# EAGLE design riffle-beta-0.1.8.5 (EAGLE 7.5.0)
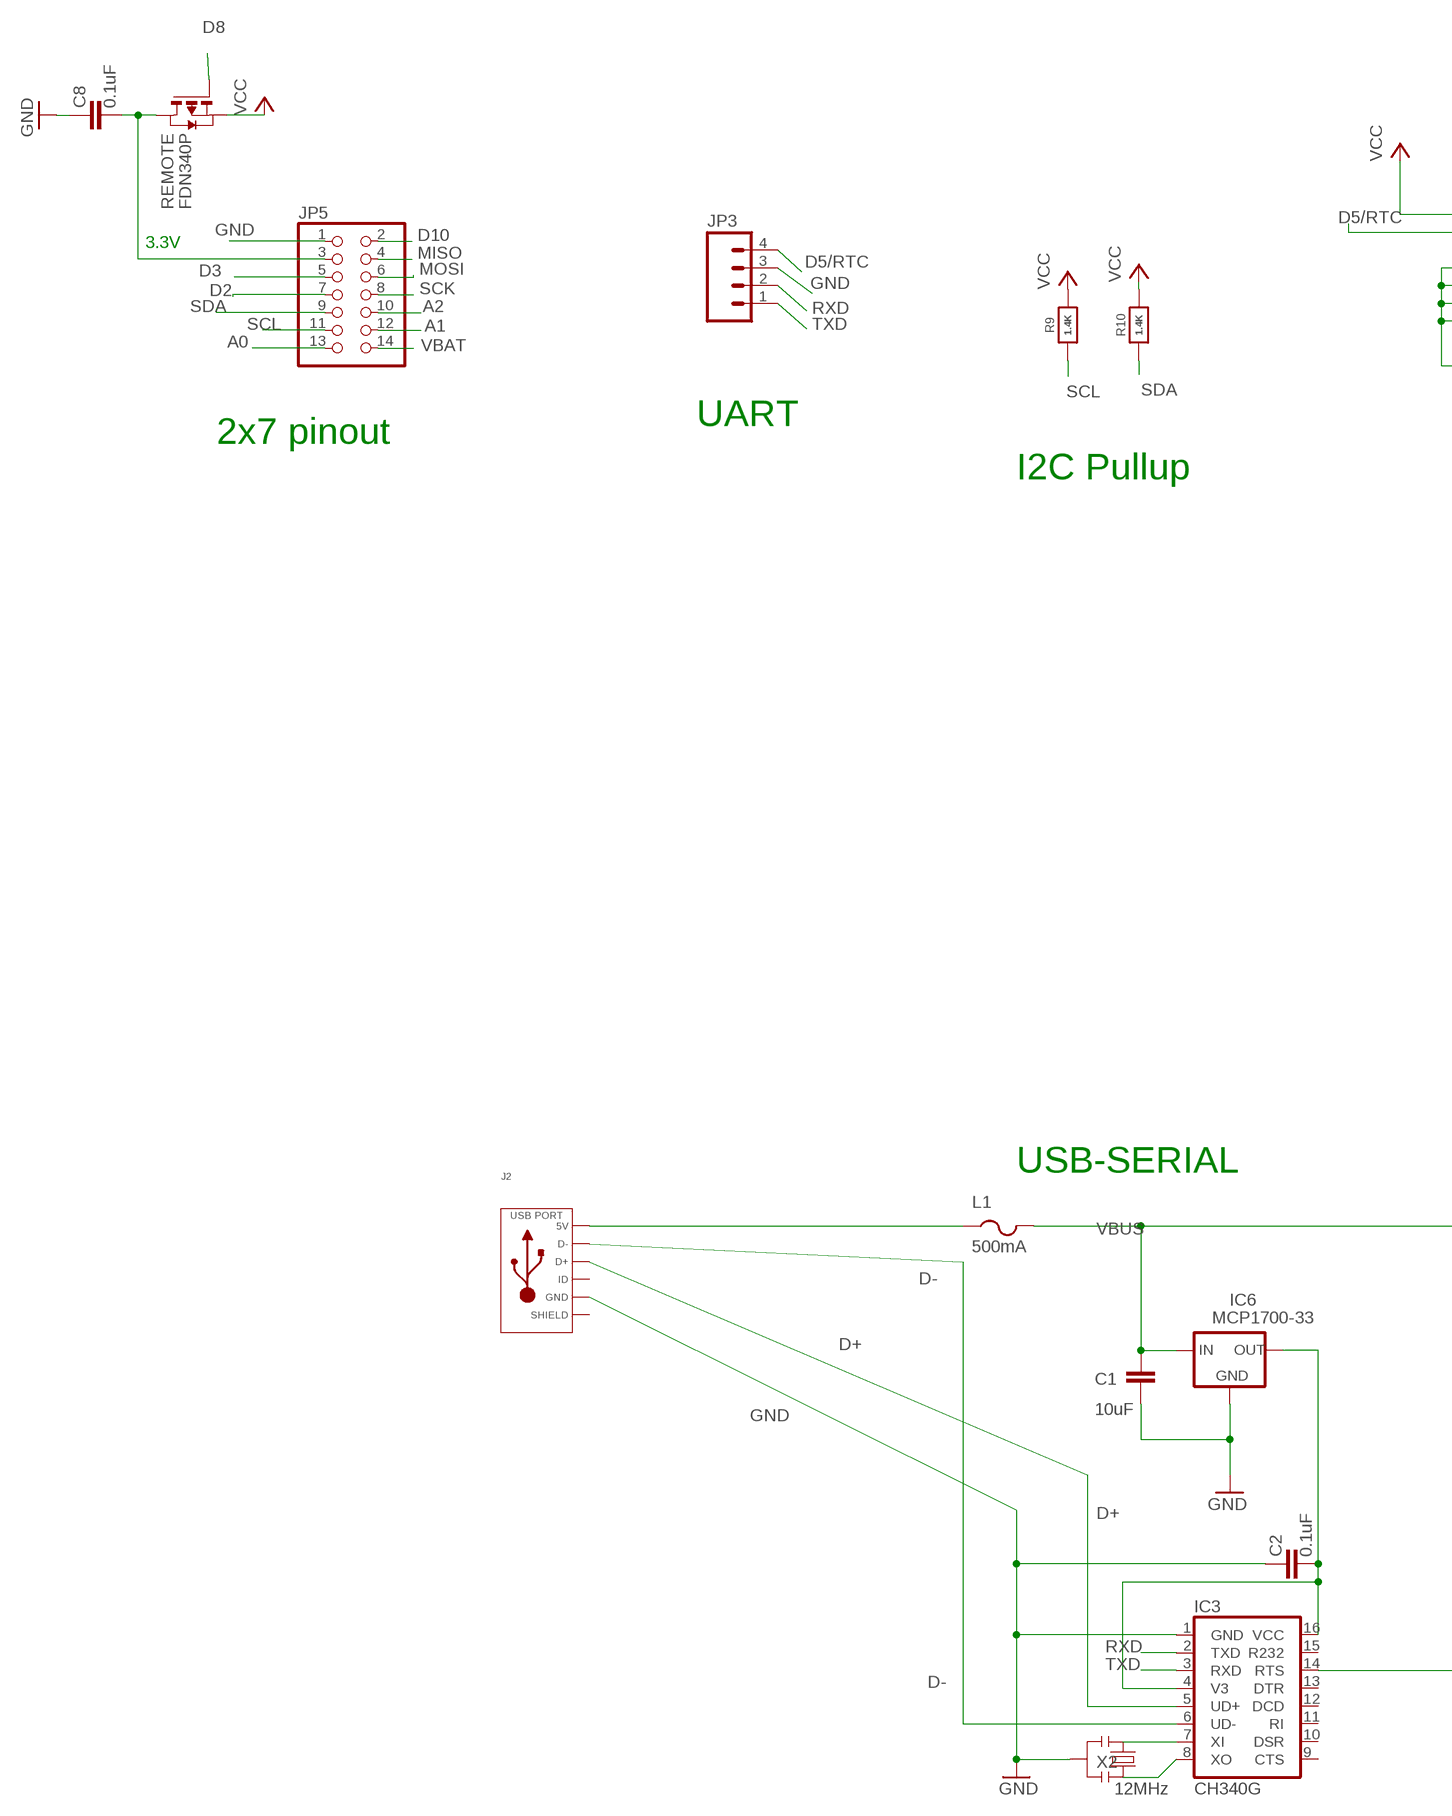
[diagram p0: schematic, sheet 1, part 1 of 2]
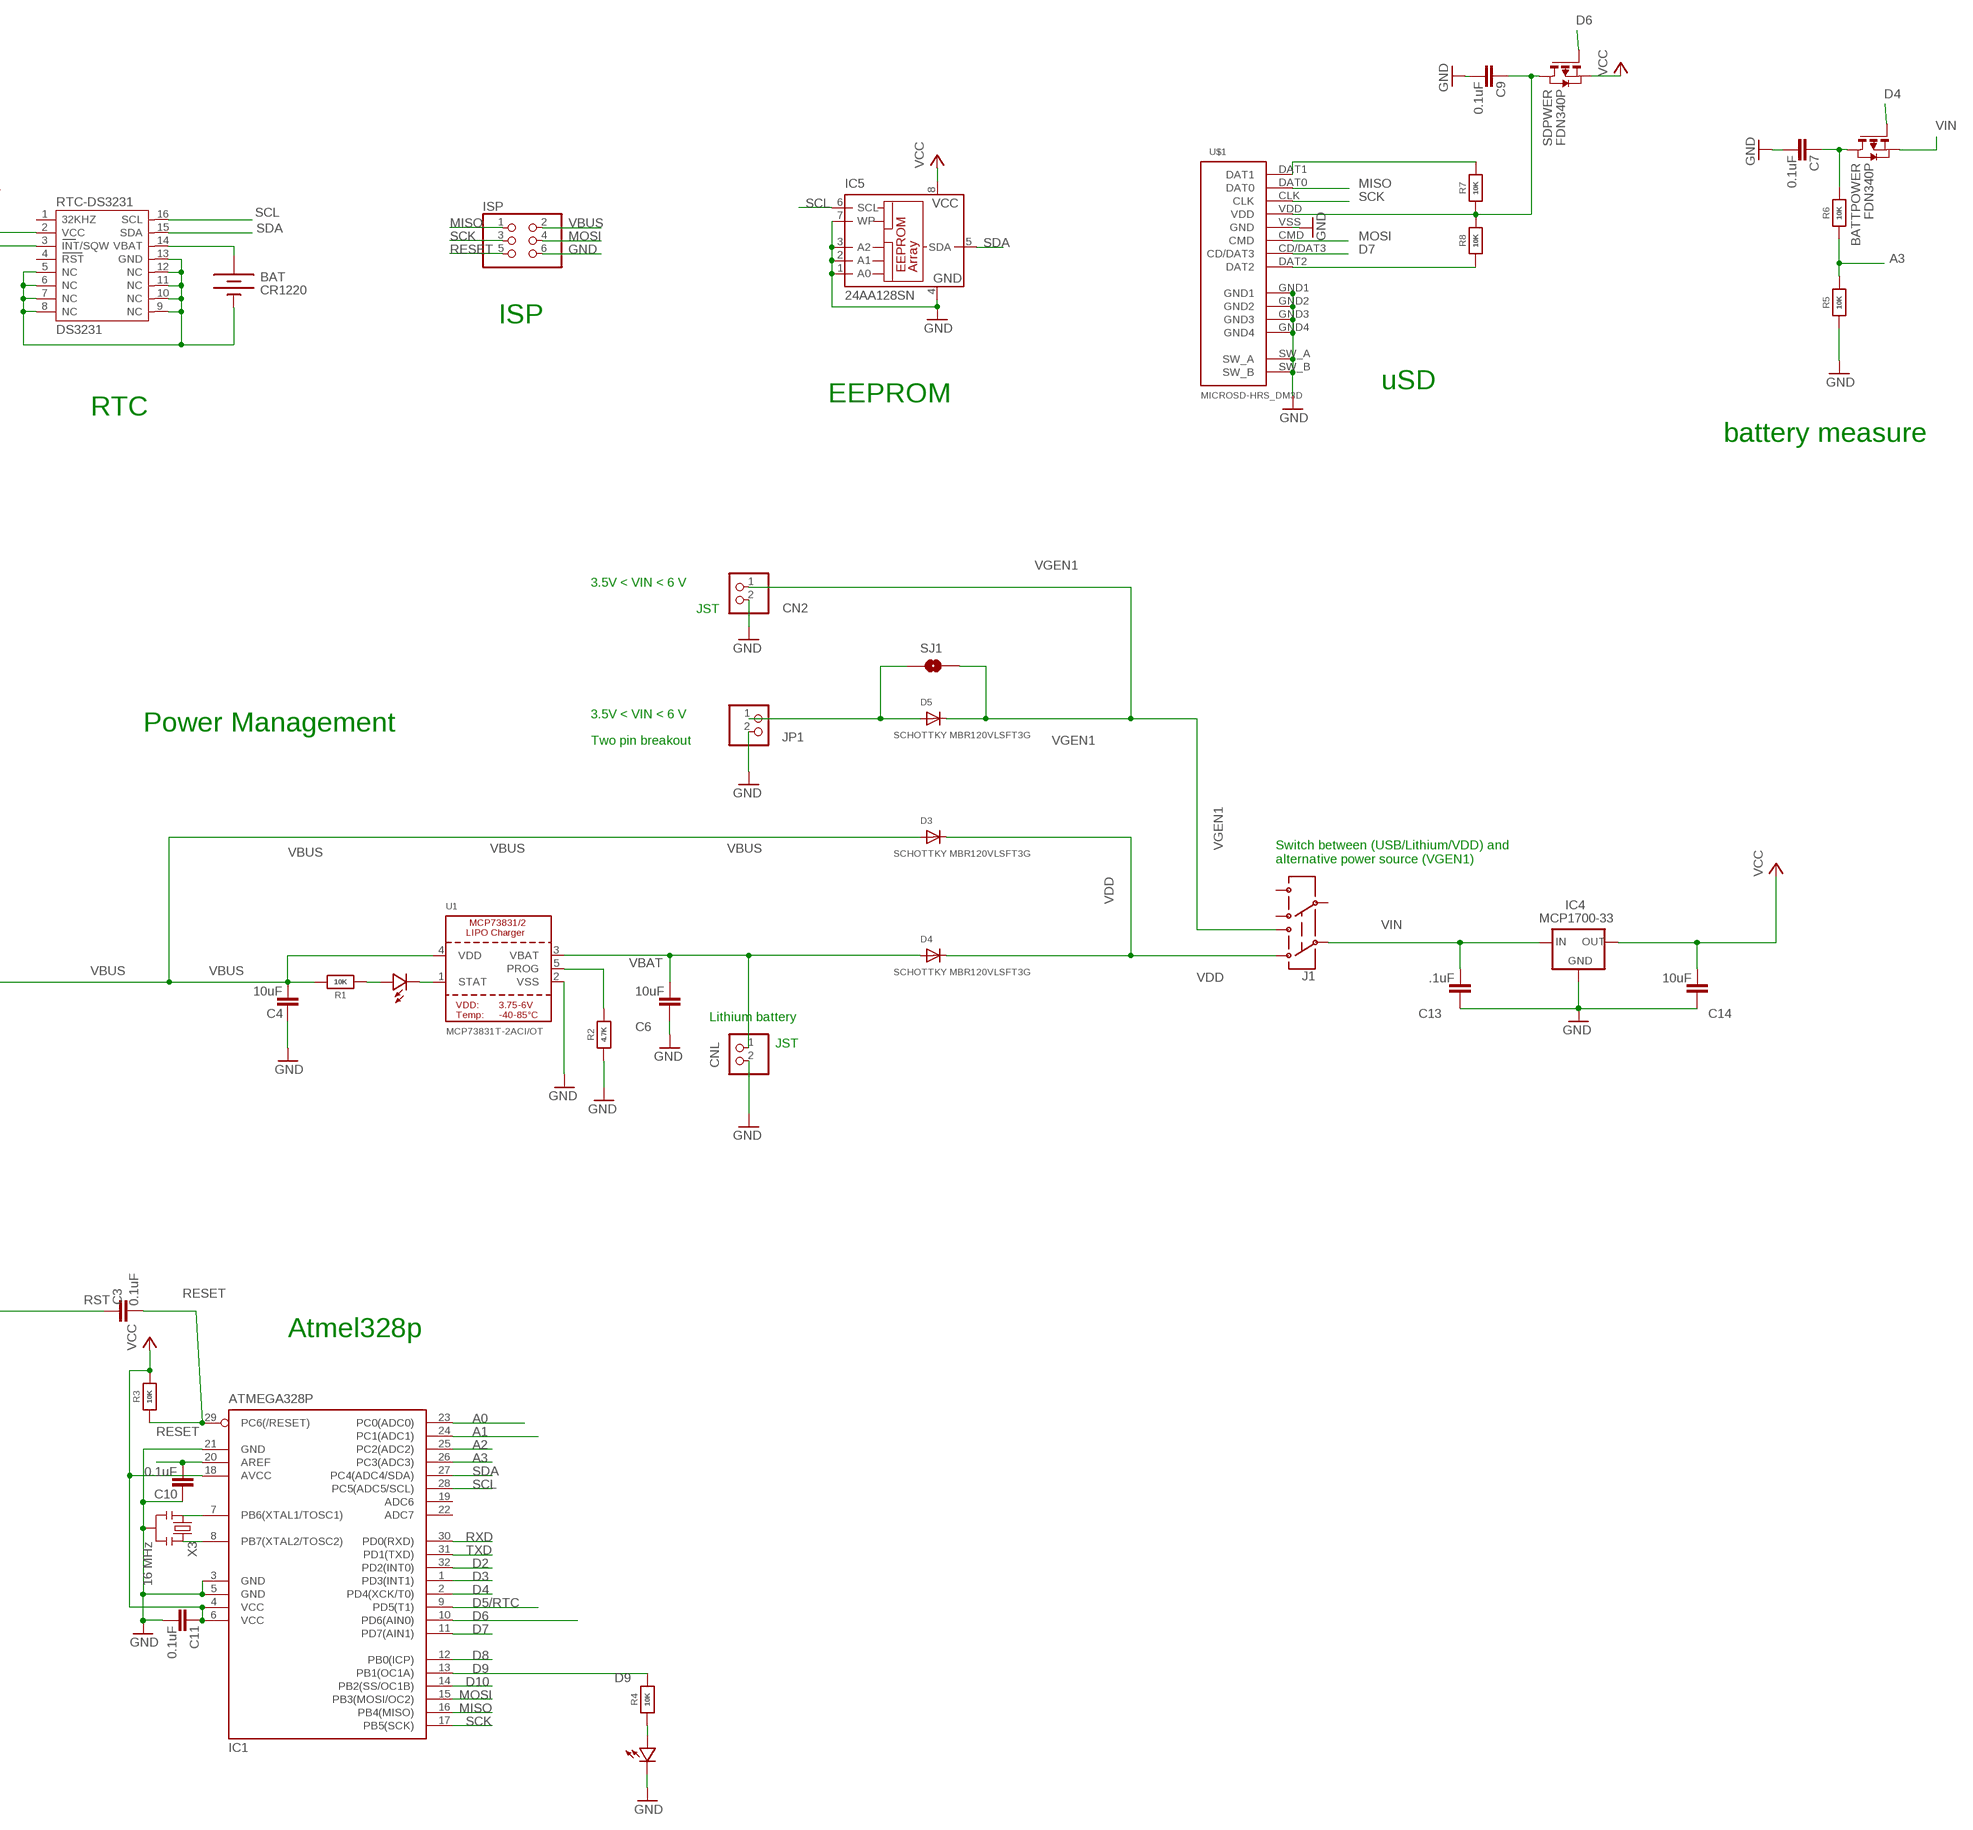
[diagram p1: schematic, sheet 1, part 2 of 2]

## Parts
BAT  CR1220  BATTERYBATTERY_12MM_SMT  [BATTCON_12MM_SMT]
BATTPOWER  FDN340P  PMOSSOT23  [SOT-23]
C1  10uF  CAP0603-CAP  [0603-CAP]
C2  0.1uF  CAP0603-CAP  [0603-CAP]
C3  0.1uF  CAP0603-CAP  [0603-CAP]
C4  10uF  CAP0603-CAP  [0603-CAP]
C6  10uF  CAP0603-CAP  [0603-CAP]
C7  0.1uF  CAP0603-CAP  [0603-CAP]
C8  0.1uF  CAP0603-CAP  [0603-CAP]
C9  0.1uF  CAP0603-CAP  [0603-CAP]
C10  0.1uF  CAP0603-CAP  [0603-CAP]
C11  0.1uF  CAP0603-CAP  [0603-CAP]
C13  .1uF  CAP0603-CAP  [0603-CAP]
C14  10uF  CAP0603-CAP  [0603-CAP]
CN2  JST_2PIN-SMT-RA  [JST-PH-2-SMT-RA]
CNL  JST_2PIN-SMT-RA  [JST-PH-2-SMT-RA]
D1  LED0603  [0603-LED]
D2  LED0603  [0603-LED]
D3  SCHOTTKY MBR120VLSFT3G  DIODE_SOD-123FL  [SOD-123FL]
D4  SCHOTTKY MBR120VLSFT3G  DIODE_SOD-123FL  [SOD-123FL]
D5  SCHOTTKY MBR120VLSFT3G  DIODE_SOD-123FL  [SOD-123FL]
IC1  ATMEGA328P  MEGA8-AI  [TQFP32-08]
IC3  CH340G  [SO16]
IC4  MCP1700-33  MCP1700SOT89  [SOT89]
IC5  24AA128SN  [SO-08]
IC6  MCP1700-33  MCP1700SOT89  [SOT89]
ISP  PINHD-2X3  [2X03]
J1  AYZ0202  [AYZ0202]
J2  USB_MICRO_RIGHT  [MICROUSB-RIGHT]
JP1  PINHD-1X2  [1X02]
JP3  M04SMD  [1X04-SMD]
JP5  PINHD-2X7  [2X07]
L1  500mA  PTCFUSE-1206  [R1206]
R1  10K  RESISTOR_0603_NOOUT  [0603-NO]
R2  4.7K  RESISTOR_0603_NOOUT  [0603-NO]
R3  10K  RESISTOR_0603_NOOUT  [0603-NO]
R4  10K  RESISTOR_0603_NOOUT  [0603-NO]
R5  10K  RESISTOR_0603_NOOUT  [0603-NO]
R6  10K  RESISTOR_0603_NOOUT  [0603-NO]
R7  10K  RESISTOR_0603_NOOUT  [0603-NO]
R8  10K  RESISTOR_0603_NOOUT  [0603-NO]
R9  1.4K  RESISTOR_0603_NOOUT  [0603-NO]
R10  1.4K  RESISTOR_0603_NOOUT  [0603-NO]
REMOTE  FDN340P  PMOSSOT23  [SOT-23]
RTC-DS3231  DS3231  [DS3231]
SDPWER  FDN340P  PMOSSOT23  [SOT-23]
SJ1  SOLDERJUMPERNO  [SJ_2S-NO]
U1  MCP73831T-2ACI/OT  MCP73831/2  [SOT23-5]
U$1  MICROSD-HRS_DM3D  [DM3D]
X2  12MHz  RESONATORSMD  [RESONATOR-SMD]
X3  16 MHz  RESONATORSMD  [RESONATOR-SMD]

## Nets
A0: IC1.23(PC0(ADC0)) JP5.13
A1: IC1.24(PC1(ADC1)) JP5.12
A2: IC1.25(PC2(ADC2)) JP5.10
A3: IC1.26(PC3(ADC3)) R5.2 R6.1
AREF: C10.1 IC1.20(AREF)
D2: IC1.32(PD2(INT0)) JP5.7
D3: IC1.1(PD3(INT1)) JP5.5
D4: BATTPOWER.3(G) IC1.2(PD4(XCK/T0))
D5/RTC: IC1.9(PD5(T1)) JP3.4 RTC-DS3231.3(INT/SQW)
D6: IC1.10(PD6(AIN0)) SDPWER.3(G)
D7: IC1.11(PD7(AIN1)) U$1.CD/DAT3
D8: IC1.12(PB0(ICP)) REMOTE.3(G)
D9: IC1.13(PB1(OC1A)) R4.2
D10: IC1.14(PB2(SS/OC1B)) JP5.2
D+: IC3.5(UD+) J2.3(D+)
D-: IC3.6(UD-) J2.2(D-)
GND: BAT.P$1(-) C1.1 C2.2 C4.2 C6.2 C7.1 C8.2 C9.1 C10.2 C11.1 C13.2 C14.2 CN2.2 CNL.2 D2.MINUS IC1.3(GND) IC1.5(GND) IC1.21(GND) IC3.1(GND) IC4.1(GND) IC5.1(A0) IC5.2(A1) IC5.3(A2) IC5.4(GND) IC5.7(WP) IC6.1(GND) ISP.6 J2.5(GND) JP1.2 JP3.3 JP5.1 R2.1 R5.1 RTC-DS3231.5(NC) RTC-DS3231.6(NC) RTC-DS3231.7(NC) RTC-DS3231.8(NC) RTC-DS3231.9(NC) RTC-DS3231.10(NC) RTC-DS3231.11(NC) RTC-DS3231.12(NC) RTC-DS3231.13(GND) U1.2(VSS) U$1.GND1 U$1.GND2 U$1.GND3 U$1.GND4 U$1.SW_A U$1.SW_B U$1.VSS(GND) X2.2 X3.2
MISO: IC1.16(PB4(MISO)) ISP.1 JP5.4 U$1.DAT0
MOSI: IC1.15(PB3(MOSI/OC2)) ISP.4 JP5.6 U$1.CMD
N$2: IC1.7(PB6(XTAL1/TOSC1)) X3.1
N$3: IC1.8(PB7(XTAL2/TOSC2)) X3.3
N$4: C9.2 R7.1 R8.2 SDPWER.1(D) U$1.VDD
N$5: D1.MINUS U1.1(STAT)
N$6: R2.2 U1.5(PROG)
N$7: C8.1 JP5.3 REMOTE.1(D)
N$8: C2.1 IC3.4(V3) IC3.16(VCC) IC6.3(OUT)
N$9: J2.1(5V) L1.1
N$10: D5.A JP1.1 SJ1.1
N$11: IC3.7(XI) X2.1
N$13: IC3.8(XO) X2.3
N$15: BATTPOWER.1(D) C7.2 R6.2
N$16: R7.2 U$1.DAT1
N$17: D2.PLUS R4.1
N$18: R8.1 U$1.DAT2
N$19: D1.PLUS R1.1
RESET: C3.1 IC1.29(PC6(/RESET)) ISP.5 R3.1
RST: C3.2 IC3.14(RTS)
RTC_BATT: BAT.P$2(+) RTC-DS3231.14(VBAT)
RXD: IC1.30(PD0(RXD)) IC3.2(TXD) JP3.2
SCK: IC1.17(PB5(SCK)) ISP.3 JP5.8 U$1.CLK
SCL: IC1.28(PC5(ADC5/SCL)) IC5.6(SCL) JP5.11 R9.1 RTC-DS3231.16(SCL)
SDA: IC1.27(PC4(ADC4/SDA)) IC5.5(SDA) JP5.9 R10.1 RTC-DS3231.15(SDA)
TXD: IC1.31(PD1(TXD)) IC3.3(RXD) JP3.1
VBAT [power]: C6.1 CNL.1 D4.A JP5.14 U1.3(VBAT)
VBUS [power]: C1.2 C4.1 D3.A IC6.2(IN) ISP.2 L1.2 R1.2 U1.4(VDD)
VCC: C11.2 C14.1 IC1.4(VCC) IC1.6(VCC) IC1.18(AVCC) IC4.3(OUT) IC5.8(VCC) R3.2 R9.2 R10.2 REMOTE.2(S) RTC-DS3231.2(VCC) SDPWER.2(S)
VDD: D3.C D4.C J1.3
VGEN1: CN2.1 D5.C J1.1 SJ1.2
VIN: BATTPOWER.2(S) C13.1 IC4.2(IN) J1.2
Unconnected: IC1.19(ADC6) IC1.22(ADC7) IC3.9(CTS) IC3.10(DSR) IC3.11(RI) IC3.12(DCD) IC3.13(DTR) IC3.15(R232) J1.4 J1.5 J1.6 J2.4(ID) RTC-DS3231.1(32KHZ) RTC-DS3231.4(RST)

## Notes on the sheet
- 3.3V
- ISP
- UART | uSD
- 2x7 pinout | EEPROM
- RTC
- I2C Pullup
- battery measure
- 3.5V < VIN < 6 V
- JST
- 3.5V < VIN < 6 V
- Power Management
- Two pin breakout
- Switch between (USB/Lithium/VDD) and 
  alternative power source (VGEN1)
- USB-SERIAL
- Lithium battery
- JST
- Atmel328p

## Power pins joined to a net without a drawn wire
SLD: J2.S1(SLD) J2.S2(SLD) J2.S3(SLD) J2.S4(SLD) J2.S5(SLD) J2.S6(SLD) J2.S7(SLD) J2.S8(SLD)

## Library data of the parts
BAT = SparkFunNew:BATTERY: Battery Holders Various common sizes : AA, AAA, 20mm coin cell and 12mm coin cell.
BATTPOWER REMOTE SDPWER = zetex:PMOSSOT23: MOS FET; OC_FARNELL: unknown; OC_NEWARK: unknown
C1-C4 C6-C11 C13 C14 = SparkFun:CAP: Capacitor Standard 0603 ceramic capacitor, and 0.1" leaded capacitor.
CN2 CNL = adafruit:JST_2PIN: JST 2-Pin Connectors of various flavors SMT-RA (S2B-PH-SM4) 4UConnector #17311 SMT (B2B-PH-SM4) THM-RA (S2B-PH) THM (B2B-PH)
D1 D2 = LowPowerLab:LED
D3-D5 = adafruit:DIODE: Diode SMADIODE - SMA Surface Mount Package 20V 1A Schottky Diode Digikey: 641-1014-6-ND DO-1N4148 - Through Hole Small Current Diode SOD-123 20V 1 A (.5mV Vf) Schottky Diode - Digikey: MBRX120TPMSCT-ND SOD-323 10V 570mA (.38mV Vf, 3ns) Schottky Diode - Digikey: ZLLS410CT-ND SOD-523 30V 30mA Schottky Diode (RB751S-40TE61) - Digikey: RB751S-40TE61CT-ND SOT23-R/W - SOT23 Package (R = Solder Paste/Reflow Ovens, W = Hand-Soldering) BAT54Film 40V 300mA - Digikey: 497-7162-1-ND
IC1 = atmel:MEGA8: MICROCONTROLLER 8 Kbytes FLASH, 1 kbytes SRAM, 512 bytes EEPROM, USART, 6-channel 10 bit ADC, 2-channel 8 bit ADC Pin compatible with Atmega48, ATMega88, ATMega168 Source: avr.lbr; MPN: ATMEGA8-16AU; OC_FARNELL: 9171371; OC_NEWARK: 73M8863
IC3 = SparkFunNew:CH340
IC4 IC6 = adafruit:MCP1700: VOLTAGE REGULATOR
IC5 = microchip:24*: Serial EEPROM I2C; MF: MICROCHIP; MPN: 24AA128-I/SN; OC_FARNELL: unknown; OC_NEWARK: 92C6842
ISP = pinhead:PINHD-2X3: PIN HEADER
J1 = SparkFunNew:AYZ0202: SPDT Slide Switch Simple SMD single-pull double-throw slide switch. Good for less than 350mA power switch, switching UARTs between devices, etc. Spark Fun Electronics SKU : COM-00597
J2 = MF_Connectors:USB: Library: MF_Connectors Description: 5 Pin USB Connectors. SLD is the shield connection. Usually tied to ground through a small ferrite bead.
JP1 = pinhead:PINHD-1X2: PIN HEADER
JP3 = SparkFun:M04: Header 4 Standard 4-pin 0.1" header. Use with straight break away headers (SKU : PRT-00116), right angle break away headers (PRT-00553), swiss pins (PRT-00743), machine pins (PRT-00117), and female headers (PRT-00115). Molex polarized connector foot print use with SKU : PRT-08231 with associated crimp pins and housings.
JP5 = pinhead:PINHD-2X7: PIN HEADER
L1 = adafruit:PTCFUSE: PTC fuses, resettable thermistors
R1-R10 = microbuilder:RESISTOR: Resistors For new designs, use the packages preceded by an '_' character since they are more reliable: The following footprints should be used on most boards: _0402 - Standard footprint for regular board layouts _0603 - Standard footprint for regular board layouts _0805 - Standard footprint for regular board layouts _1206 - Standard footprint for regular board layouts For extremely tight-pitch boards where space is at a premium, the following 'micro-pitch' footprints can be used (smaller pads, no silkscreen outline, etc.): _0402MP - Micro-pitch footprint for very dense/compact boards _0603MP - Micro-pitch footprint for very dense/compact boards _0805MP - Micro-pitch footprint for very dense/compact boards _1206MP - Micro-pitch footprint for very dense/compact boards
RTC-DS3231 = _lh-library:DS3231
SJ1 = SparkFun-Retired:SOLDERJUMPER: Solder Jumper Standard SMD solder jumper. Used to automate production. Two varients : Normally Open and Normally Closed are the same, but have different paste layers. NC will have a large amount of paste and should jumper during reflow.
U1 = microbuilder:MCP73831/2: MCP73831/2 LIPO Charger VDD: 3.75 - 6V Temp -40 - 85°C Programmable Charge Rate: 15-500mA NOTE: STAT is a tri-state logic output on the MCP73831 and an open-drain output on the MCP73832. SOT23-5 with 4.2V output and tri-state logic on STAT = MCP73831T-2ACI/OT
U$1 = hrs_DM3D-SF:MICROSD-HRS_DM3D
X2 = SparkFunNew:RESONATOR: Resonator Small SMD resonator. This is the itty bitty 10/20MHz resonators with built in caps. CSTCE10M0G55 and CSTCE20M0V53. Footprint has been reviewed closely but hasn't been tested yet.
X3 = SparkFun:RESONATOR: Resonator Small SMD resonator. This is the itty bitty 10/20MHz resonators with built in caps. CSTCE10M0G55 and CSTCE20M0V53. Footprint has been reviewed closely but hasn't been tested yet.

## Net classes
1 power: width 0.305 mm

## Board
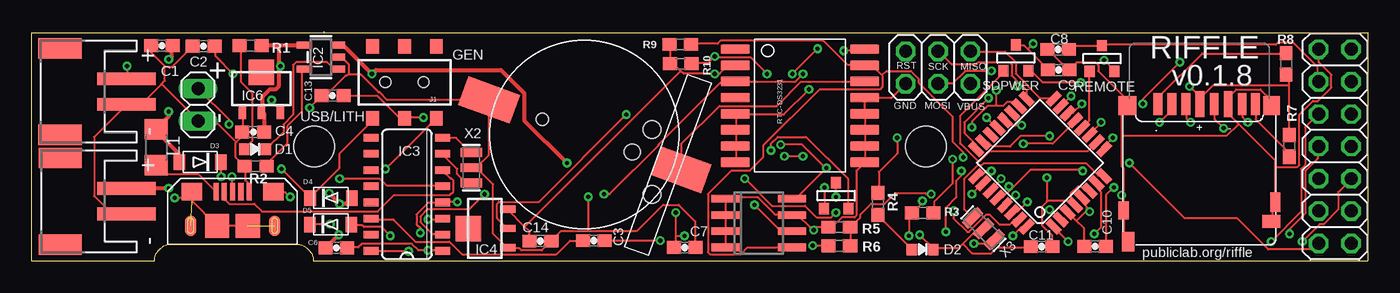
[diagram p2: board, top side]
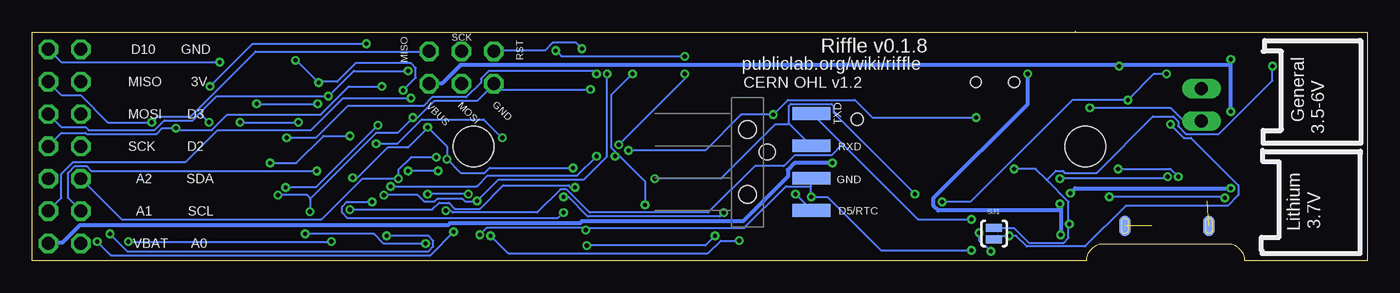
[diagram p3: board, bottom side, seen from below]

Size 104.8 x 18.01 mm. Coordinates in mm from the lower left corner, seen from the top.
Outline: 22.91,18.01 22.96,18.01
Outline: 0,0 0,17.96 104.8,17.96 104.8,0 22.07,0 arc90 20.75,1.32 10.95,1.32 arc90 9.63,0 0,0
Copper layers (1*16): Top 0.0356mm / dielectric 1.5011mm / Bottom 0.0356mm
Design rules "LaenPCBOrder": minimum track width 6mil, minimum drill 13mil, track to track 6mil, track to pad 6mil, pad to pad 6mil, via to via 6mil, smd to smd 6mil, copper to edge 15mil, drill to drill 6mil, minimum pad ring 7mil, minimum via ring 7mil, stop-mask expansion 3mil, vias tented up to drill 0mil, thermal gap 10mil
Holes 3.2 mm at 70.13,9 22.13,9

### Footprints (pad centres in the part's own frame; a part is rotated, then mirrored left to right if it is on the bottom)
BATTCON_12MM_SMT = smd 2.4 x 4.3: P$1 0,11.96 | smd 2.4 x 4.2: P$2 0,-4.1 | hole 0.95: 0,7.5 | hole 1.25: 0,0
SOT-23 = smd 0.787 x 0.889: 1 0.025,-1.016; 2 -0.94,1.016; 3 0.991,1.016
0603-CAP = smd 1.1 x 1: 1 -0.85,0; 2 0.85,0
JST-PH-2-SMT-RA = smd 1 x 4.6: 1 1,-3.7; 2 -1,-3.7 | smd 1.6 x 3.4: NC1 -3.4,1.5; NC2 3.4,1.5
0603-LED = smd 0.8 x 0.9: MINUS -0.85,0; PLUS 0.85,0
SOD-123FL = smd 0.91 x 1.22: A 1.637,0; C -1.637,0
TQFP32-08 = smd 1.27 x 0.559: 1 -4.293,2.8; 2 -4.293,2; 3 -4.293,1.2; 4 -4.293,0.4; 5 -4.293,-0.4; 6 -4.293,-1.2; 7 -4.293,-2; 8 -4.293,-2.8; 17 4.293,-2.8; 18 4.293,-2; 19 4.293,-1.2; 20 4.293,-0.4; 21 4.293,0.4; 22 4.293,1.2; 23 4.293,2; 24 4.293,2.8 | smd 0.559 x 1.27: 9 -2.8,-4.293; 10 -2,-4.293; 11 -1.2,-4.293; 12 -0.4,-4.293; 13 0.4,-4.293; 14 1.2,-4.293; 15 2,-4.293; 16 2.8,-4.293; 25 2.8,4.293; 26 2,4.293; 27 1.2,4.293; 28 0.4,4.293; 29 -0.4,4.293; 30 -1.2,4.293; 31 -2,4.293; 32 -2.8,4.293
SO16 = smd 0.6 x 1.2: 1 -4.445,-2.8; 2 -3.175,-2.8; 3 -1.905,-2.8; 4 -0.635,-2.8; 5 0.635,-2.8; 6 1.905,-2.8; 7 3.175,-2.8; 8 4.445,-2.8; 9 4.445,2.8; 10 3.175,2.8; 11 1.905,2.8; 12 0.635,2.8; 13 -0.635,2.8; 14 -1.905,2.8; 15 -3.175,2.8; 16 -4.445,2.8
SOT89 = smd 0.58 x 1.2: 1 -1.5,-1.8; 2 0,-1.8; 3 1.5,-1.8 | smd 2 x 2: 4 0,1.3
SO-08 = smd 0.6 x 2.2: 1 -1.905,-2.6; 2 -0.635,-2.6; 3 0.635,-2.6; 4 1.905,-2.6; 5 1.905,2.6; 6 0.635,2.6; 7 -0.635,2.6; 8 -1.905,2.6
2X03 = drill 1.016 octagon: 1 -2.54,-1.27; 2 -2.54,1.27; 3 0,-1.27; 4 0,1.27; 5 2.54,-1.27; 6 2.54,1.27
AYZ0202 = smd 1 x 1.15: 1 -2.5,2.825; 2 0,2.825; 3 2.5,2.825; 4 -2.5,-2.825; 5 0,-2.825; 6 2.5,-2.825 | hole 0.85: 1.5,0; -1.5,0
MICROUSB-RIGHT = smd 0.4 x 1.35: 1 -1.3,1.27; 2 -0.65,1.27; 3 0,1.27; 4 0.65,1.27; 5 1.3,1.27 | smd 0.9 x 1.6: S1 -3.3,-1.4; S2 3.3,-1.4 | smd 1.6 x 1.4: S3 -3.2,1.27; S4 3.2,1.27 | smd 1.9 x 1.9: S5 -1.2,-1.405; S6 1.2,-1.405 | smd 0.9 x 1.6 bottom: S7 -3.3,-1.4; S8 3.3,-1.4
1X02 = drill 1.016 long: 1 -1.27,0; 2 1.27,0
1X04-SMD = smd 1 x 3: 1 -3.81,5; 2 -1.27,5; 3 1.27,5; 4 3.81,5 | hole 1.4: -2.54,0; 2.54,0
2X07 = drill 1.016 octagon: 1 -7.62,-1.27; 2 -7.62,1.27; 3 -5.08,-1.27; 4 -5.08,1.27; 5 -2.54,-1.27; 6 -2.54,1.27; 7 0,-1.27; 8 0,1.27; 9 2.54,-1.27; 10 2.54,1.27; 11 5.08,-1.27; 12 5.08,1.27; 13 7.62,-1.27; 14 7.62,1.27
R1206 = smd 1.6 x 1.803: 1 -1.422,0; 2 1.422,0
0603-NO = smd 1.1 x 1: 1 -0.85,0; 2 0.85,0
DS3231 = smd 0.762 x 2.286: 1 -4.445,-5.08; 2 -3.175,-5.08; 3 -1.905,-5.08; 4 -0.635,-5.08; 5 0.635,-5.08; 6 1.905,-5.08; 7 3.175,-5.08; 8 4.445,-5.08; 9 4.445,5.08; 10 3.175,5.08; 11 1.905,5.08; 12 0.635,5.08; 13 -0.635,5.08; 14 -1.905,5.08; 15 -3.175,5.08; 16 -4.445,5.08
SJ_2S-NO = smd 0.635 x 1.27: 1 -0.45,0; 2 0.45,0
SOT23-5 = smd 0.55 x 1.2: 1 -0.95,-1.3; 2 0,-1.3; 3 0.95,-1.3; 4 0.95,1.3; 5 -0.95,1.3
DM3D = smd 0.7 x 1.75: CD/DAT3 8.15,0.45; CLK 4.85,0.45; CMD 7.05,0.45; DAT0 2.65,0.45; DAT1 1.6,0.45; DAT2 9.25,0.45 | smd 0.8 x 1.5: GND1 0.05,8.15 | smd 0.8 x 1.4: GND2 11.95,8.8 | smd 1.4 x 1.5: GND3 11.65,0.55 | smd 1.3 x 1.5: GND4 0.35,0.55 | smd 1 x 1.55: SW_A 11.6,11.25 | smd 1.4 x 1: SW_B 0.35,9.65 | smd 0.7 x 2.032: VDD 5.95,0.45; VSS 3.75,0.45
RESONATOR-SMD = smd 0.7 x 1.7: 1 -1.2,0; 2 0,0; 3 1.2,0

### Placement (x,y rotation side)
BAT  47.1,8.57 70 top
BATTPOWER  63.12,5.14 180 top
C1  10.2,16.92 0 top
C2  13.48,16.89 180 top
C3  44.09,1.61 180 top
C4  17.37,10.13 180 top
C6  23.9,1.04 0 top
C7  51.21,1.07 180 top
C8  80.53,16.62 180 top
C9  80.57,15.01 180 top
C10  83.41,1.16 180 top
C11  79.23,1.13 0 top
C13  23.6,13 180 top
C14  39.9,1.57 0 top
CN2  3.71,13.31 90 top
CNL  3.72,4.7 90 top
D1  17.52,8.79 180 top
D2  69.88,0.92 180 top
D3  13.21,7.77 180 top
D4  23.47,4.95 0 top
D5  23.44,2.87 0 top
IC1  79.09,7.72 135 top
IC3  29.42,5.24 90 top
IC4  35.53,2.57 90 top
IC5  57.02,2.98 270 top
IC6  18.01,13.54 0 top
ISP  71.1,15.2 180 top
J1  29.24,14.05 180 top
J2  15.75,4.17 0 top
JP1  13.04,12.26 270 top
JP3  48.64,7.78 270 bottom
JP5  102.23,9.01 270 top
L1  9.75,8.94 90 top
R1  17.16,16.91 0 top
R2  17.56,7.44 0 top
R3  69.89,3.78 0 top
R4  66.37,4.5 90 top
R5  63.35,2.66 0 top
R6  63.35,1.19 180 top
R7  98.65,9.05 270 top
R8  98.4,15.49 270 top
R9  50.91,15.5 180 top
R10  50.88,17.03 180 top
REMOTE  83.98,15.91 180 top
RTC-DS3231  60.27,12.21 270 top
SDPWER  77.23,15.95 180 top
SJ1  29.31,2.16 90 bottom
U1  22.68,16.03 90 top
U$1  97.6,12.78 180 top
X2  34.49,7.33 90 top
X3  74.66,2.55 135 top

### Tracks (layer width: path | path; a pad name or v marks a point on that pad's centre or on a via)
A0  (via drill 0.33)
  Top 0.152: v79.86,9.83 77.57,9.83 76.73,8.99 75.36,8.99 75.06,9.3 74.68,9.3 IC1.23 | v86.11,7.7 90.45,3.35 94.56,3.35 97,0.91 100.43,0.91 100.89,1.37 JP5.13
  Bottom 0.152: v79.86,9.83 81.91,9.83 84.05,7.7 v86.11,7.7
A1  (via drill 0.33)
  Top 0.152: v75.06,12.8 73.15,10.9 73.15,10.06 74.07,9.14 74.07,8.84 IC1.24
  Bottom 0.152: v75.06,12.8 80.39,12.8 82.91,10.29 90.22,10.29 92.74,7.77 101.57,7.77 102.49,6.86 102.49,4.95 103.48,3.96 JP5.12
A2  (via drill 0.33)
  Top 0.152: v75.29,7.09 74.9,7.09 74.52,6.71 74.14,6.71 IC1.25 | v72.92,7.09 72.92,6.71 72.54,6.33 72.54,5.03 71.7,4.19 v71.7,2.29 | v99.67,1.52 101.04,2.9 101.35,2.9 102.49,4.04 102.49,5.41 103.48,6.4 JP5.10
  Bottom 0.152: v72.92,7.09 v75.29,7.09 | v71.7,2.29 73.53,0.46 98.6,0.46 v99.67,1.52
A3  (via drill 0.33)
  Top 0.152: R6.1 64.24,1.22 64.24,2.59 R5.2 64.24,2.67 65,3.43 65,3.66 65.84,4.5 66.9,4.5 67.74,5.33 70.1,5.33 70.18,5.26 v70.56,5.26 | v73.76,5.26 74.6,6.1 IC1.26
  Bottom 0.152: v70.56,5.26 v73.76,5.26
AREF  (via drill 0.33)
  Top 0.152: v84.89,5.79 84.28,5.18 84.28,1.22 C10.1 | v77.65,10.67 76.66,10.67 76.35,10.97 IC1.20
  Bottom 0.152: v84.89,5.79 82.52,5.79 v77.65,10.67
D2  (via drill 0.33)
  Top 0.152: v76.96,1.98 77.65,2.67 78.03,2.67 IC1.32 | v98.68,2.13 98.68,2.52 99.9,3.73 99.9,7.09 100.89,8.08 100.89,8.99 JP5.7
  Bottom 0.152: v76.96,1.98 73.69,1.98 73.3,1.6 73.3,1.14 73.69,0.76 97.31,0.76 v98.68,2.13
D3  (via drill 0.33)
  Top 0.152: v81.31,1.52 80.16,2.67 IC1.1 | v97.23,1.52 99.59,3.89 99.59,7.24 99.9,7.54 99.9,10.52 100.89,11.51 JP5.5
  Bottom 0.152: v97.23,1.52 v81.31,1.52
D4  (via drill 0.33)
  Top 0.152: v62.18,5.79 62.18,4.19 BATTPOWER.3 | v79.86,4.04 80.7,3.2 IC1.2
  Bottom 0.152: v62.18,5.79 62.56,5.79 62.71,5.94 67.82,5.94 69.65,4.12 71.63,4.12 72.09,4.57 72.85,4.57 73.38,4.04 v79.86,4.04
D5/RTC  (via drill 0.33)
  Top 0.152: v84.81,9.68 84.12,8.99 84.12,8.84 IC1.9 | v60.5,14.71 59.89,14.1 55.24,14.1 RTC-DS3231.3 55.17,14.1 54.1,14.1 49.15,9.14 49.15,9.07 45.34,5.26 v44.88,5.26
  Bottom 0.152: v84.81,9.68 82.52,9.68 80.01,12.19 74.07,12.19 73.38,12.88 70.71,12.88 69.57,14.02 69.57,14.33 68.96,14.94 60.73,14.94 v60.5,14.71 | v44.88,5.26 43.66,4.04 JP3.4
D6
  Top 0.152: SDPWER.3 76.2,14.94 76.2,14.78 72.85,11.43 72.85,9.22 74.22,7.85 74.37,7.85 75.13,8.61 82.83,8.61 83.52,9.3 IC1.10
D7  (via drill 0.33)
  Top 0.152: v83.9,10.9 82.98,9.98 IC1.11 | v88.47,10.9 89.38,11.81 89.38,12.27 U$1.CD/DAT3
  Bottom 0.152: v88.47,10.9 v83.9,10.9
D8
  Top 0.152: REMOTE.3 82.98,14.86 82.98,11.05 82.45,10.52 IC1.12
D9  (via drill 0.33)
  Top 0.152: v67.89,9.68 67.89,8.46 66.45,7.01 66.45,5.41 R4.2 | v77.8,9.22 80.09,9.22 81.84,10.97 IC1.13
  Bottom 0.152: v67.89,9.68 69.34,11.12 74.22,11.12 76.12,9.22 v77.8,9.22
D10  (via drill 0.33)
  Top 0.152: v82.37,12.34 81.69,11.66 81.31,11.66 IC1.14 | v87.17,12.34 87.17,12.72 v90.07,15.62
  Bottom 0.152: v87.17,12.34 v82.37,12.34 | v90.07,15.62 102.49,15.62 103.48,16.61 JP5.2
D+  (via drill 0.33)
  Top 0.152: v24.16,6.48 27.28,6.48 27.81,5.94 32.16,5.94 IC3.5 | v15.7,6.63 15.7,5.49 J2.3
  Bottom 0.152: v24.16,6.48 15.85,6.48 v15.7,6.63
D-
  Top 0.152: IC3.6 32.23,7.09 32.84,6.48 32.92,6.48 33.07,6.33 33.07,5.49 32.77,5.18 28.42,5.18 27.13,3.89 18.06,3.89 17.45,4.5 15.47,4.5 15.16,4.8 15.16,5.41 J2.2
GND  (via drill 0.33)
  Top 0.152: IC6.1 16.54,11.73 16.54,10.13 C4.2 16.46,10.06 16.46,9.75 16.04,9.34 | J2.5 16.99,5.49 16.99,6.1 16.76,6.33 16.76,7.39 R2.1 16.69,7.47 16,8.15 16,9.3 16.04,9.34 | 16.04,9.34 14.4,10.97 13.11,10.97 JP1.2 13.03,11.05 10.17,13.91 | 10.48,15.28 10.52,15.24 10.97,15.24 12.57,16.84 C2.2 | 10.48,15.28 9.37,16.38 9.37,16.92 C1.1 | 10.17,13.91 8.61,12.34 7.47,12.34 CN2.2 7.39,12.27 4.88,9.75 4.88,5.11 6.25,3.73 7.39,3.73 CNL.2 | 10.17,13.91 10.44,14.17 10.44,15.24 10.48,15.28 | 24.8,14.67 24.84,14.71 24.84,15.47 24.31,16 24,16 U1.2 | 24.8,14.67 24.69,14.55 24.61,14.55 23.09,13.03 22.78,13.03 C13.2 22.71,12.95 v21.79,12.04 | 24.8,14.67 24.84,14.63 25.83,14.63 27.2,13.26 27.28,13.26 27.89,12.65 35.74,12.65 BAT.P$1 35.81,12.65 35.81,8.31 34.9,7.39 34.52,7.39 X2.2 34.98,7.39 34.98,7.24 36.19,6.02 36.19,2.13 37.26,1.07 IC4.1 37.34,0.99 38.25,0.99 38.4,0.84 40,0.84 40.69,1.52 C14.2 40.77,1.6 41.53,2.36 43.66,2.36 | C6.2 24.76,1.07 25.6,1.07 25.91,1.37 29.79,1.37 30.33,0.84 v31.09,0.84 32.16,0.84 IC3.1 32.23,0.84 | 43.66,2.36 47.47,2.36 49.53,4.42 50.75,4.42 52.04,3.12 52.04,1.14 C7.1 | 43.66,2.36 v43.66,5.03 | U$1.SW_A 85.95,1.6 85.72,1.83 85.72,3.96 U$1.GND2 85.65,4.04 85.65,5.18 | C8.2 79.71,16.61 81.23,15.09 81.38,15.09 C9.1 81.46,15.09 81.99,15.62 83.44,15.62 83.67,15.39 83.67,14.94 85.88,12.72 85.88,12.27 U$1.GND3 85.88,12.19 85.5,11.81 85.5,9.83 | 85.65,5.18 85.65,7.32 85.5,7.47 85.5,9.83 | U$1.SW_B 97.31,3.2 97.31,4.34 97.54,4.57 U$1.GND1 97.54,4.65 97.54,7.39 | U$1.GND4 97.23,12.27 97.23,12.65 96.39,13.49 94.49,13.49 93.88,12.88 93.88,12.34 U$1.VSS 93.88,12.27 93.88,11.58 94.68,10.78
  Top 0.152: 97.54,7.39 97.54,7.92 94.68,10.78 | 97.54,7.39 99.29,7.39 99.44,7.54 99.44,11.51 100.51,12.57 100.89,12.57 101.96,13.64 101.96,14.63 100.96,15.62 100.96,16.61 JP5.1 | 85.5,9.83 93.73,9.83 94.68,10.78 | 73.04,1.33 74.22,2.52 74.6,2.52 X3.2 | 73.04,1.33 72.69,0.99 70.79,0.99 D2.MINUS 70.71,0.99 v69.65,2.06 | 73.04,1.33 73.76,0.61 75.29,0.61 75.74,1.07 78.33,1.07 C11.1 | 61.34,2.67 61.04,2.67 60.12,3.58 59.66,3.58 IC5.7 59.59,3.66 58.29,3.66 56.92,5.03 54.56,5.03 54.48,4.95 IC5.1 54.41,4.88 54.41,3.66 IC5.2 54.41,3.58 54.41,2.36 IC5.3 54.41,2.29 54.41,1.14 IC5.4 54.41,1.07 | 61.34,2.67 62.48,2.67 R5.1 62.56,2.67 62.79,2.67 63.55,3.43 64.54,3.43 64.69,3.58 64.69,7.09 65.3,7.7 RTC-DS3231.9 65.38,7.77 65.38,8.99 RTC-DS3231.10 65.38,9.07 65.38,10.29 RTC-DS3231.11 65.38,10.36 65.38,11.51 RTC-DS3231.12 65.38,11.58 65.38,12.8 RTC-DS3231.13 65.46,12.8 67.44,12.8 68.5,13.87 ISP.6 | 61.34,2.67 v61.34,2.44 | RTC-DS3231.8 55.24,7.77 55.24,8.99 RTC-DS3231.7 55.24,9.07 55.24,10.29 RTC-DS3231.6 55.24,10.36 55.24,11.51 RTC-DS3231.5 55.32,11.51 58.98,11.51 v60.96,13.49 | 81.95,3.16 81.31,3.81 IC1.3 | 81.95,3.16 82.52,2.59 82.52,1.22 C10.2 | 81.95,3.16 82.72,3.92 | 82.72,3.92 82.75,3.96 82.75,4.27 82.45,4.57 82.45,4.95 IC1.5 | 75.74,10.52 IC1.21 75.67,10.52 v74.9,11.28 | v82.98,3.89 82.75,3.89 82.72,3.92 | v85.5,5.18 85.65,5.18
  Bottom 0.152: 43.66,5.87 v43.66,5.03 42.37,5.03 38.18,0.84 v31.09,0.84 | 43.66,5.87 43.66,6.48 JP3.3 | v21.79,12.04 15.47,12.04 14.48,11.05 13.11,11.05 JP1.2 | v69.65,2.06 69.11,2.59 61.49,2.59 v61.34,2.44 61.42,2.59 48.92,2.59 45.64,5.87 43.66,5.87 | v82.98,3.89 82.98,4.88 82.94,4.92 | 82.94,4.92 77.8,10.06 76.12,10.06 v74.9,11.28 74.52,11.28 73.23,12.57 69.88,12.57 68.58,13.87 ISP.6 68.5,13.87 68.12,13.49 v60.96,13.49 | v85.5,5.18 83.21,5.18 82.94,4.92
MISO  (via drill 0.33)
  Top 0.152: IC1.16 80.09,12.8 79.1,12.8 77.19,14.71 77.19,15.62 76.35,16.46 73.69,16.46 ISP.1 | v95.4,10.9 95.02,11.28 95.02,12.27 U$1.DAT0
  Bottom 0.152: JP5.4 103.48,14.02 102.49,13.03 100.96,13.03 98.83,10.9 v95.4,10.9 94.95,11.35 92.35,11.35 87.25,16.46 73.69,16.46 ISP.1
MOSI  (via drill 0.33)
  Top 0.152: v81.53,12.95 80.77,12.19 IC1.15 | v90.91,10.9 90.6,11.2 90.6,12.27 U$1.CMD | v75.29,14.94 73.23,14.94 72.24,13.95 71.17,13.95 ISP.4
  Bottom 0.152: 91.63,11.62 92.2,11.05 94.41,11.05 95.17,10.29 100.36,10.29 100.58,10.52 102.49,10.52 103.48,11.51 JP5.6 | 91.63,11.62 90.3,12.95 v81.53,12.95 79.55,14.94 v75.29,14.94 | 91.63,11.62 v90.91,10.9
N$2  (via drill 0.33)
  Top 0.152: v83.36,2.13 83.9,2.67 83.9,5.41 83.59,5.71 83.59,6.1 IC1.7 | v73.91,1.37 75.13,1.37 75.44,1.68 X3.1
  Bottom 0.152: v83.36,2.13 77.95,2.13 77.19,1.37 v73.91,1.37
N$3
  Top 0.152: IC1.8 84.05,6.71 83.67,6.71 82.68,7.7 74.68,7.7 74.52,7.54 74.22,7.54 73.15,6.48 73.15,4.04 73.76,3.43 X3.3
N$4  (via drill 0.33)
  Top 0.152: 78.14,16.65 79.71,15.09 C9.2 | 78.14,16.65 77.88,16.92 77.27,16.92 SDPWER.1 | 98.6,13.79 98.6,14.48 98.45,14.63 R8.2 | 98.6,13.79 98.6,9.91 R7.1 | 98.6,13.79 92.66,13.79 91.67,12.8 91.67,12.34 U$1.VDD 91.67,12.88 v90.83,13.72 | v78.56,17.07 78.14,16.65
  Bottom 0.152: v78.56,17.07 87.48,17.07 v90.83,13.72
N$5
  Top 0.152: D1.MINUS 18.44,8.84 19.74,10.13 19.74,10.74 20.5,11.51 20.5,15.39 20.73,15.62 23.16,15.62 23.7,15.09 23.93,15.09 U1.1
N$6
  Top 0.152: R2.2 18.44,7.47 18.44,7.62 20.04,9.22 20.04,10.59 21.18,11.73 21.18,14.86 21.34,15.01 U1.5
N$7
  Top 0.152: C8.1 81.38,16.69 81.61,16.92 83.9,16.92 REMOTE.1 83.97,16.99 97.61,16.99 97.76,17.14 98.98,17.14 100.89,15.24 100.89,14.1 JP5.3
N$8  (via drill 0.33)
  Top 0.152: v29.57,0.76 26.67,0.76 IC3.16 | v30.48,2.21 30.48,2.59 30.18,2.9 30.18,3.66 31.09,4.57 32.16,4.57 IC3.4 32.23,4.65 v33.38,4.65 | v15.77,14.71 14.4,16.08 14.4,16.84 C2.1 | v18.82,12.65 18.82,12.5 19.51,11.81 IC6.3
  Bottom 0.152: v29.57,0.76 29.95,1.14 30.02,1.14 30.48,1.6 v30.48,2.21 | v15.77,14.71 16.76,14.71 v18.82,12.65 23.16,12.65 31.17,4.65 v33.38,4.65
N$9
  Top 0.152: J2.1 14.4,5.49 13.03,6.86 10.36,6.86 9.75,7.47 L1.1
N$10  (via drill 0.33)
  Top 0.152: v28.12,1.98 27.43,2.67 26.06,2.67 25.91,2.82 25.15,2.82 D5.A | v15.47,10.74 15.47,11.12 13.11,13.49 JP1.1
  Bottom 0.152: SJ1.1 29.26,1.75 29.03,1.98 v28.12,1.98 27.58,1.98 26.75,1.14 22.17,1.14 18.97,4.34 10.97,4.34 10.13,5.18 10.13,5.94 13.87,9.68 14.4,9.68 v15.47,10.74
N$11
  Top 0.152: IC3.7 32.23,8.38 33.38,7.24 33.38,6.86 34.06,6.17 34.44,6.17 X2.1
N$13
  Top 0.152: IC3.8 32.23,9.68 33.3,9.68 34.44,8.53 X2.3
N$15  (via drill 0.33)
  Top 0.152: v63.09,5.03 63.09,6.1 BATTPOWER.1 | 50.52,1.98 50.52,1.29 50.37,1.14 C7.2 | 50.52,1.98 v50.52,3.81 | v61.26,1.22 62.48,1.22 R6.2 | 50.52,1.98 v51.21,1.98
  Bottom 0.152: v63.09,5.03 62.71,5.03 61.19,3.5 50.83,3.5 v50.52,3.81 | v61.26,1.22 51.97,1.22 v51.21,1.98
N$16
  Top 0.152: R7.2 98.6,8.23 98.6,8.53 96.01,11.12 96.01,12.27 U$1.DAT1
N$17
  Top 0.152: D2.PLUS 68.96,0.99 66.37,3.58 R4.1
N$18
  Top 0.152: R8.1 98.37,16.31 91.82,16.31 88.39,12.88 88.39,12.34 U$1.DAT2
N$19
  Top 0.152: D1.PLUS 16.69,8.84 17.3,9.45 17.3,13.18 16.38,14.1 16.38,16.84 R1.1
RESET  (via drill 0.33)
  Top 0.152: v49.3,1.6 44.96,1.6 C3.1 | v68.81,1.98 68.81,3.5 69.04,3.73 R3.1 69.11,3.81 69.88,4.57 v69.88,4.72 | v77.19,5.18 77.11,5.18 76.35,4.42 IC1.29 | v59.66,14.71 v61.65,16.69
  Bottom 0.152: v49.3,1.6 50.75,1.6 51.74,0.61 67.44,0.61 v68.81,1.98 | v77.19,5.18 74.52,5.18 73.99,4.65 73.23,4.65 73,4.88 71.02,4.88 70.79,4.65 69.95,4.65 v69.88,4.72 68.2,6.4 61.49,6.4 59.66,8.23 v59.66,14.71 | v61.65,16.69 62.1,17.14 63.93,17.14 64.54,16.54 68.5,16.54 ISP.5
RST
  Top 0.152: C3.2 43.21,1.6 42.21,1.6 41.15,0.53 33.76,0.53 32.77,1.52 30.1,1.52 28.35,3.28 26.67,3.28 IC3.14
RTC_BATT
  Top 0.152: RTC-DS3231.14 65.3,14.1 60.35,14.1 58.45,12.19 53.95,12.19 50.98,9.22 50.98,7.24 BAT.P$2
RXD  (via drill 0.33)
  Top 0.152: v35.51,5.26 34.29,4.04 31.01,4.04 30.48,3.5 30.48,3.05 31.39,2.13 32.16,2.13 IC3.2 | v78.1,4.65 77.34,3.89 76.96,3.89 IC1.30 | v63.09,3.81 62.71,3.43 61.57,3.43 60.66,4.34 58.06,4.34 v55.93,6.48
  Bottom 0.152: v35.51,5.26 41.91,11.66 41.91,12.19 42.06,12.34 45.26,12.34 45.42,12.19 45.42,10.82 45.38,10.78 | 45.38,10.78 43.66,9.07 JP3.2 | v78.1,4.65 80.09,4.65 80.47,4.27 80.47,3.81 80.01,3.35 63.55,3.35 v63.09,3.81 | v55.93,6.48 50.75,6.48 46.48,10.74 45.42,10.74 45.38,10.78
SCK  (via drill 0.33)
  Top 0.152: 77.53,13.91 76.89,14.55 76.89,15.47 76.73,15.62 74.22,15.62 74.07,15.47 72.16,15.47 71.17,16.46 ISP.3 | 77.53,13.91 78.03,13.41 78.03,12.8 IC1.17 | v93.5,10.44 92.81,11.12 92.81,12.27 U$1.CLK | v77.34,13.72 77.53,13.91
  Bottom 0.152: JP5.8 103.48,9.07 102.49,10.06 100.58,10.06 100.51,9.98 95.02,9.98 94.56,10.44 v93.5,10.44 93.34,10.29 90.68,10.29 89.46,11.51 82.14,11.51 79.93,13.72 v77.34,13.72
SCL  (via drill 0.33)
  Top 0.152: v63.7,16.54 65.23,16.54 65.3,16.61 RTC-DS3231.16 | R9.1 51.82,15.54 53.04,15.54 v53.57,16.08 53.57,16 56.39,16 v57.68,14.71 | v56.69,4.42 58.75,2.36 59.59,2.36 IC5.6 | 76.85,5.68 78.33,7.16 82.37,7.16 v82.45,7.09 | 76.85,5.68 76.2,5.03 75.82,5.03 IC1.28 | v60.5,8.23 v59.05,8.23 | 76.85,5.68 v76.66,5.87
  Bottom 0.152: v53.57,16.08 63.25,16.08 v63.7,16.54 | v56.69,4.42 56.69,6.25 58.86,8.42 | 58.86,8.42 59.36,8.91 59.36,13.03 v57.68,14.71 | v82.45,7.09 100.13,7.09 100.51,7.47 101.42,7.47 101.96,6.93 101.96,4.95 100.96,3.96 JP5.11 | v59.05,8.23 58.86,8.42 | v60.5,8.23 62.03,6.71 69.04,6.71 69.88,5.87 v76.66,5.87
SDA  (via drill 0.33)
  Top 0.152: v76.05,6.48 76.05,6.4 75.21,5.56 IC1.27 | R10.1 51.74,17.07 53.8,17.07 54.03,17.3 62.1,17.3 64.01,15.39 65.3,15.39 RTC-DS3231.15 65.38,15.32 65.99,15.32 66.71,14.59 | 66.71,14.59 66.75,14.55 66.75,13.72 66.52,13.49 61.8,13.49 57.38,9.07 57.38,8.15 56.31,7.09 54.86,7.09 53.04,5.26 53.04,0.69 53.19,0.53 55.63,0.53 56.16,1.07 59.59,1.07 IC5.5 | v73.08,8.15 73.08,8.53 72.24,9.37 72.24,11.35 69.57,14.02 69.57,14.33 68.96,14.94 67.06,14.94 66.71,14.59
  Bottom 0.152: JP5.9 100.89,6.4 97.76,3.28 82.07,3.28 78.87,6.48 v76.05,6.48 76.05,7.16 75.06,8.15 v73.08,8.15
SLD  (via drill 0.33)  (4 unrouted)
  Top 0.152: 12.57,4.95 12.57,4.72 14.48,2.82 J2.S5 14.55,2.82 16.92,2.82 J2.S6 | 12.57,4.95 12.57,5.41 J2.S3 12.57,4.95 | v20.27,5.03 19.89,5.41 18.97,5.41 J2.S4 | 12.57,4.95 v11.2,4.95
  Bottom 0.152: v20.27,5.03 11.28,5.03 v11.2,4.95
TXD  (via drill 0.33)
  Top 0.152: v31.09,3.28 32.16,3.28 IC3.3 | v72.31,3.96 72.31,3.35 73.38,2.29 73.53,2.29 74.9,3.66 75.13,3.66 75.9,2.9 76.73,2.9 77.04,3.2 77.42,3.2 IC1.31
  Bottom 0.152: v31.09,3.28 35.28,3.28 41.19,9.18 | 41.19,9.18 43.59,11.58 JP3.1 | v72.31,3.96 71.93,3.96 71.78,3.81 65.15,3.81 63.32,5.64 62.86,5.64 61.04,3.81 51.74,3.81 48.08,7.47 45.8,7.47 44.96,8.31 42.06,8.31 41.19,9.18
VBAT  (via drill 0.33)
  Top 0.305: v24.08,2.06 23.09,1.07 C6.1 | D4.A 25.07,4.95 24.61,4.5 v24.16,4.5 v23.32,5.33 | U1.3 24,16.92 24.46,16.92 v26.67,14.71 26.97,15.01 36.8,15.01 38.63,13.18 38.63,11.05 v41.99,7.7 | v10.74,5.71 7.47,5.71 CNL.1
  Bottom 0.305: 24.08,3.96 24.08,4.42 v24.16,4.5 | 24.08,3.96 v24.08,2.06 | v26.67,14.71 26.67,12.34 34.06,4.95 34.06,4.34 33.68,3.96 24.08,3.96 | v41.99,7.7 44.96,7.7 45.49,7.16 45.49,6.63 49,3.12 61.65,3.12 61.8,2.97 72.01,2.97 72.16,2.82 101.04,2.82 102.41,1.45 103.48,1.45 JP5.14 | v10.74,5.71 22.94,5.71 v23.32,5.33
VBUS  (via drill 0.33)
  Top 0.305: C4.1 18.21,11.58 18.06,11.73 IC6.2 18.06,11.89 18.06,12.88 18.67,13.49 19.13,13.49 19.35,13.72 19.35,15.32 | 19.35,16.92 21.34,16.92 U1.4 | 19.35,16.92 18.06,16.92 R1.2 | 19.35,16.92 19.35,15.32 | v10.74,15.85 10.97,16.08 10.97,16.92 C1.2 | v10.74,11.73 10.74,11.35 L1.2 | L1.2 | D3.A 11.51,7.77 11.51,8.46 9.75,10.21 L1.2 | v19.51,15.32 19.35,15.32
  Bottom 0.305: v10.74,11.73 10.74,15.39 | 10.74,15.39 v10.74,15.85 | 10.74,15.39 19.51,15.39 | 19.51,15.39 71.17,15.39 72.62,13.95 73.61,13.95 ISP.2 | v19.51,15.32 19.51,15.39
VCC  (via drill 0.33)
  Top 0.152: 38.67,2.71 37.34,4.04 IC4.3 | 38.67,2.71 39.01,2.36 39.01,1.6 C14.1 | R10.2 50.06,16.99 50.06,15.54 R9.2 50.14,15.54 50.29,15.54 50.9,14.94 | 50.9,14.94 51.13,14.71 v53.57,14.71 53.95,14.71 54.56,15.32 55.17,15.32 RTC-DS3231.2 | 50.9,14.94 38.67,2.71 | 79.67,4.69 79.71,4.72 81.53,4.72 | 79.67,4.69 79.25,4.27 79.25,2.82 80.01,2.06 80.01,1.14 C11.2 | 81.53,4.72 81.84,4.42 IC1.4 81.53,4.72 | 81.53,4.72 81.53,5.33 82.07,5.87 82.3,5.87 82.6,5.56 82.91,5.56 IC1.6 | v82.3,14.02 79.32,14.02 78.41,14.94 78.18,14.94 SDPWER.2 | v84.12,15.77 84.96,14.94 REMOTE.2 | 59.59,4.88 IC5.8 59.66,4.95 59.97,4.95 v62.33,7.32 62.26,7.32 60.43,9.14 v58.75,9.14 | v72.24,8 72.24,6.1 70.79,4.65 70.79,3.81 R3.2 | v73.76,10.52 73.76,10.97 74.98,12.19 75.67,12.19 | 75.67,12.19 76.2,12.19 76.5,12.5 77.11,12.5 77.42,12.19 IC1.18 | 75.67,12.19 v75.67,13.41 | v79.63,6.55 79.63,4.72 79.67,4.69
  Bottom 0.152: v84.12,15.77 84.05,15.77 v82.3,14.02 82.3,14.1 80.85,14.1 79.4,15.54 75.06,15.54 74.68,15.16 74.68,14.4 v75.67,13.41 | v62.33,7.32 68.88,7.32 69.27,6.93 71.17,6.93 v72.24,8 72.24,8.99 v73.76,10.52 73.76,10.44 75.29,8.91 76.89,8.91 79.25,6.55 v79.63,6.55 | v53.57,14.71 53.57,14.33 v58.75,9.14
VDD  (via drill 0.33)
  Top 0.152: J1.3 26.67,11.2 26.67,10.97 24.16,8.46 24.16,7.32 21.79,4.95 D4.C 21.79,5.03 v19.58,7.24 | v14.86,6.63 14.86,7.77 D3.C
  Bottom 0.152: v14.86,6.63 15.47,7.24 v19.58,7.24
VGEN1  (via drill 0.33)
  Top 0.152: v27.74,7.24 31.7,11.2 J1.1 | v23.39,2.9 21.87,2.9 D5.C | v7.47,15.32 7.47,14.33 CN2.1
  Bottom 0.152: v27.74,7.24 26.06,7.24 25.18,6.36 | 25.18,6.36 23.47,4.65 23.47,2.9 | 23.47,2.9 23.47,1.83 23.85,1.45 26.59,1.45 27.74,2.59 29.26,2.59 SJ1.2 | 23.47,2.9 v23.39,2.9 | v7.47,15.32 7.47,14.17 11.66,9.98 14.25,9.98 14.86,10.59 14.86,10.97 15.24,11.35 16.84,11.35 21.26,6.93 23.77,6.93 23.93,7.09 24.46,7.09 25.18,6.36
VIN  (via drill 0.33)
  Top 0.152: C13.1 24.46,12.95 27.13,12.95 28.8,11.28 29.18,11.28 J1.2 29.26,11.28 v30.71,11.28 | v57.99,8.69 57.99,9.22 58.52,9.75 60.73,9.75 64.01,6.48 64.01,4.19 BATTPOWER.2 | v46.63,11.51 39.78,4.65 36.65,4.65 36.5,4.5 36.5,3.35 37.26,2.59 IC4.2
  Bottom 0.152: v57.99,8.69 51.97,8.69 49.15,11.51 v46.63,11.51 45.49,12.65 40.23,12.65 38.86,11.28 v30.71,11.28

### Text on the board
tPlace: GEN | RST | SCK | RIFFLE | IC2 | MISO | + | v0.1.8 | IC6 | - | USB/LITH | GND | MOSI | VBUS | X2 | IC3 | IC4 | publiclab.org/riffle
bPlace: SCK | Riffle v0.1.8 | GND | D10 | General | RST | MISO | publiclab.org/wiki/riffle | CERN OHL v1.2 | 3V | MISO | TXD | VBUS | D3 | MOSI | GND | MOSI | 3.5-6V | RXD | D2 | SCK | Lithium | SDA | A2 | GND | D5/RTC | SCL | A1 | 3.7V | A0 | VBAT